# EAGLE design current shunt (EAGLE 8.3.2)

## Sheet 1 of 3
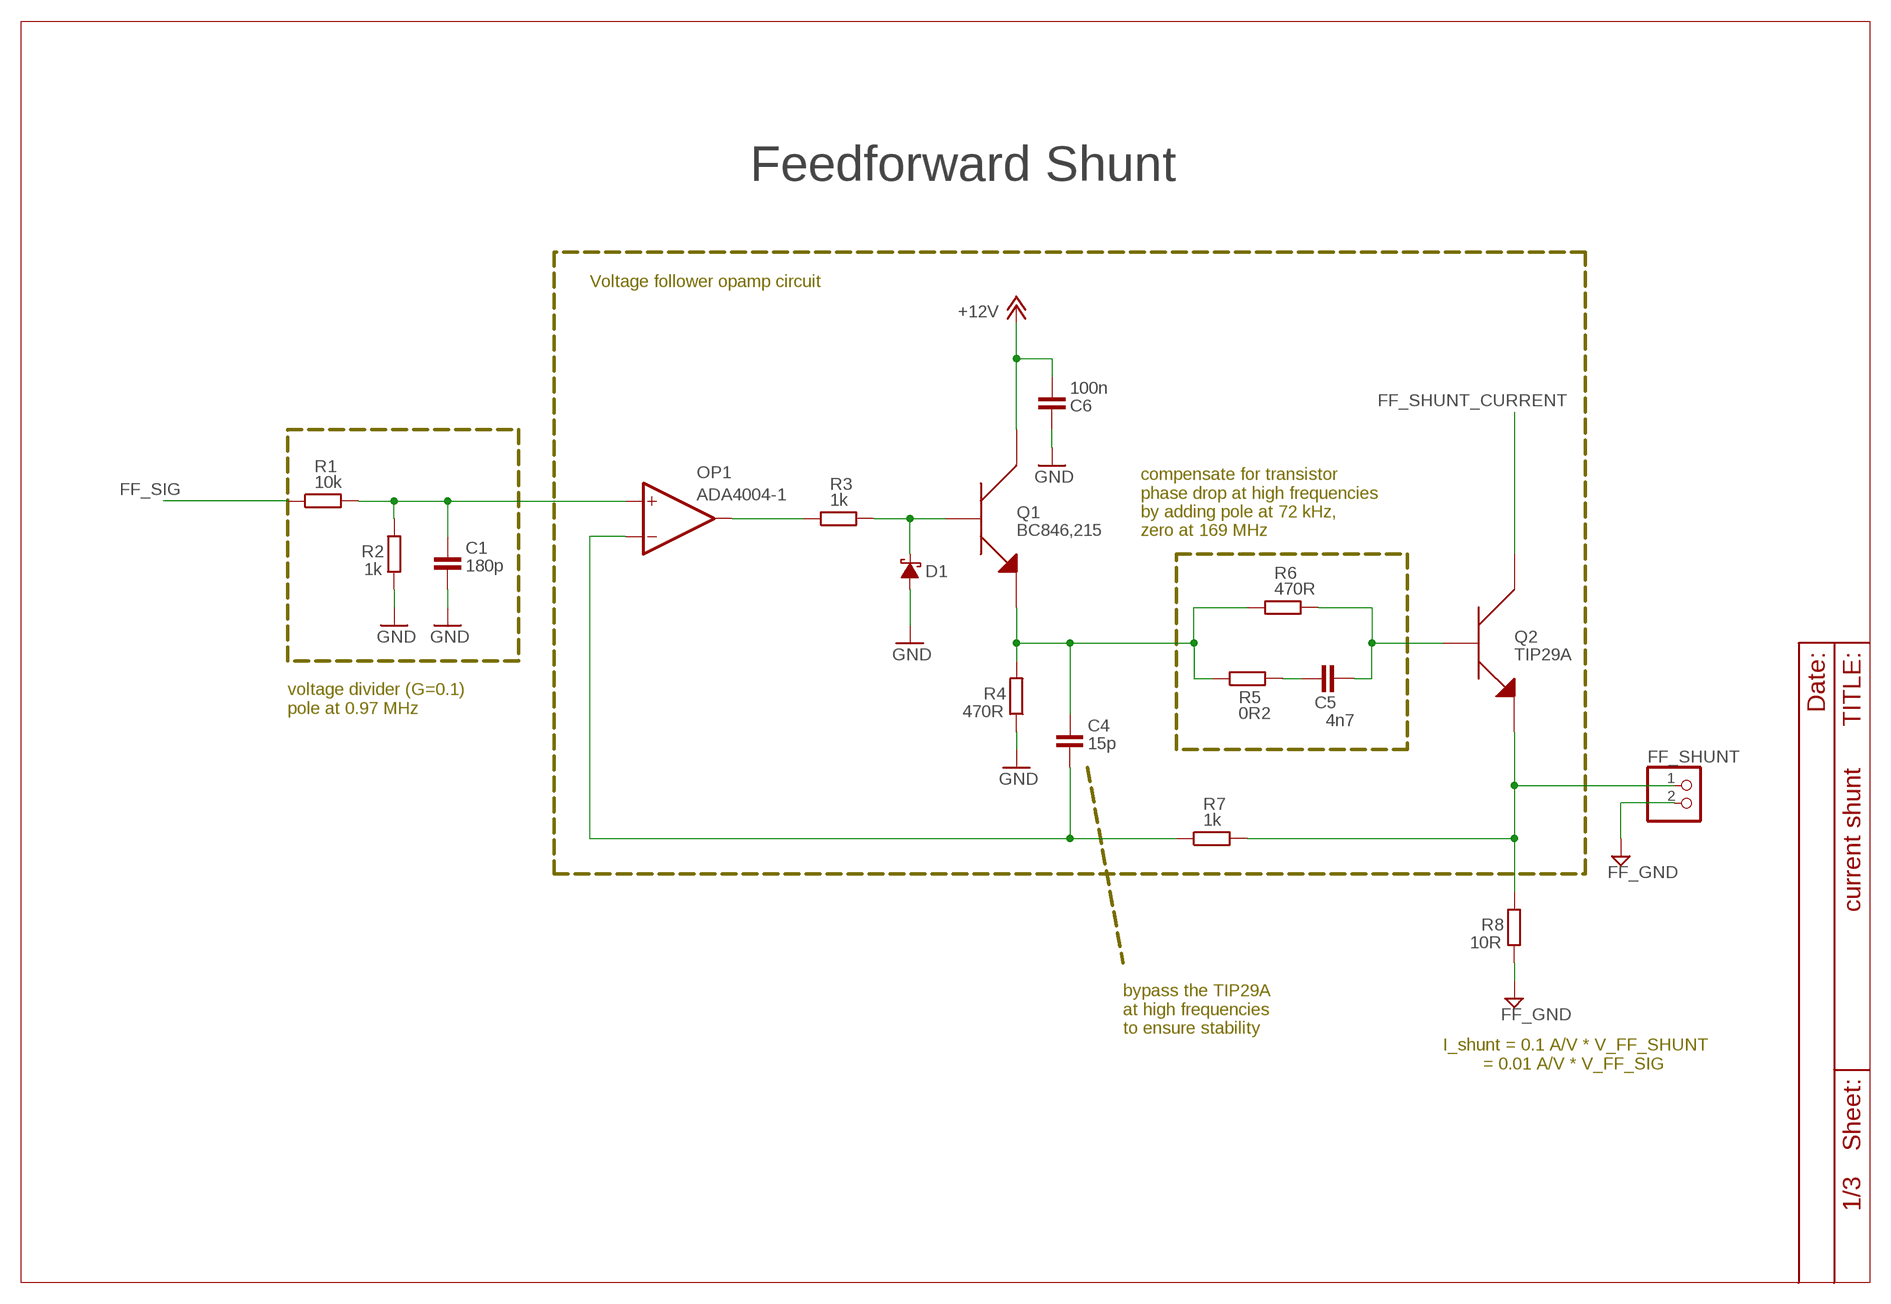
[diagram p0: schematic, sheet 1]

### Parts
C1  180p  CAP0603  [0603]
C4  15p  CAP0603  [0603]
C5  4n7  CAP0603  [0603]
C6  100n  CAP0603  [0603]
D1  DIODE_SCHOTTKY  [SOD123F]
FF_SHUNT  PINHD-1X2  [1X02]
OP1  ADA4004-1  OPAMPSOT23-5  [SOT23-5]
Q1  BC846,215  [SOT23]
Q2  TIP29A  [TO-220_DETATCHED]
R1  10k  RES0603  [0603]
R2  1k  RES0603  [0603]
R3  1k  RES0603  [0603]
R4  470R  RES0603  [0603]
R5  0R2  RES0603  [0603]
R6  470R  RES0603  [0603]
R7  1k  RES0603  [0603]
R8  10R  RES0603  [0603]

### Nets
+12V: C6.1 Q1.3(COLLECTOR) ; also sheet 2,3
FB_SHUNT: FF_SHUNT.1 Q2.EMITTER R7.2 R8.2
FF_GND: FF_SHUNT.2 R8.1 ; also sheet 3
FF_SHUNT_CURRENT: Q2.COLLECTOR ; also sheet 3
FF_SIG: R1.1 ; also sheet 3
GND: C1.2 C6.2 D1.P$2(A) R2.1 R4.1 ; also sheet 2,3
N$1: C4.2 OP1.4(-IN) R7.1
N$2: C1.1 OP1.3(+IN) R1.2 R2.2
N$3: C5.1 R5.2
N$4: OP1.1(OUT) R3.1
N$5: D1.P$1(K) Q1.1(BASE) R3.2
N$8: C4.1 Q1.2(EMITTER) R4.2 R5.1 R6.1
N$9: C5.2 Q2.BASE R6.2

### Notes on the sheet
- Feedforward Shunt
- Voltage follower opamp circuit
- compensate for transistor 
  phase drop at high frequencies
  by adding pole at 72 kHz, 
  zero at 169 MHz
- voltage divider (G=0.1)
  pole at 0.97 MHz
- bypass the TIP29A 
  at high frequencies 
  to ensure stability
- I_shunt = 0.1 A/V * V_FF_SHUNT
          = 0.01 A/V * V_FF_SIG

## Sheet 2 of 3
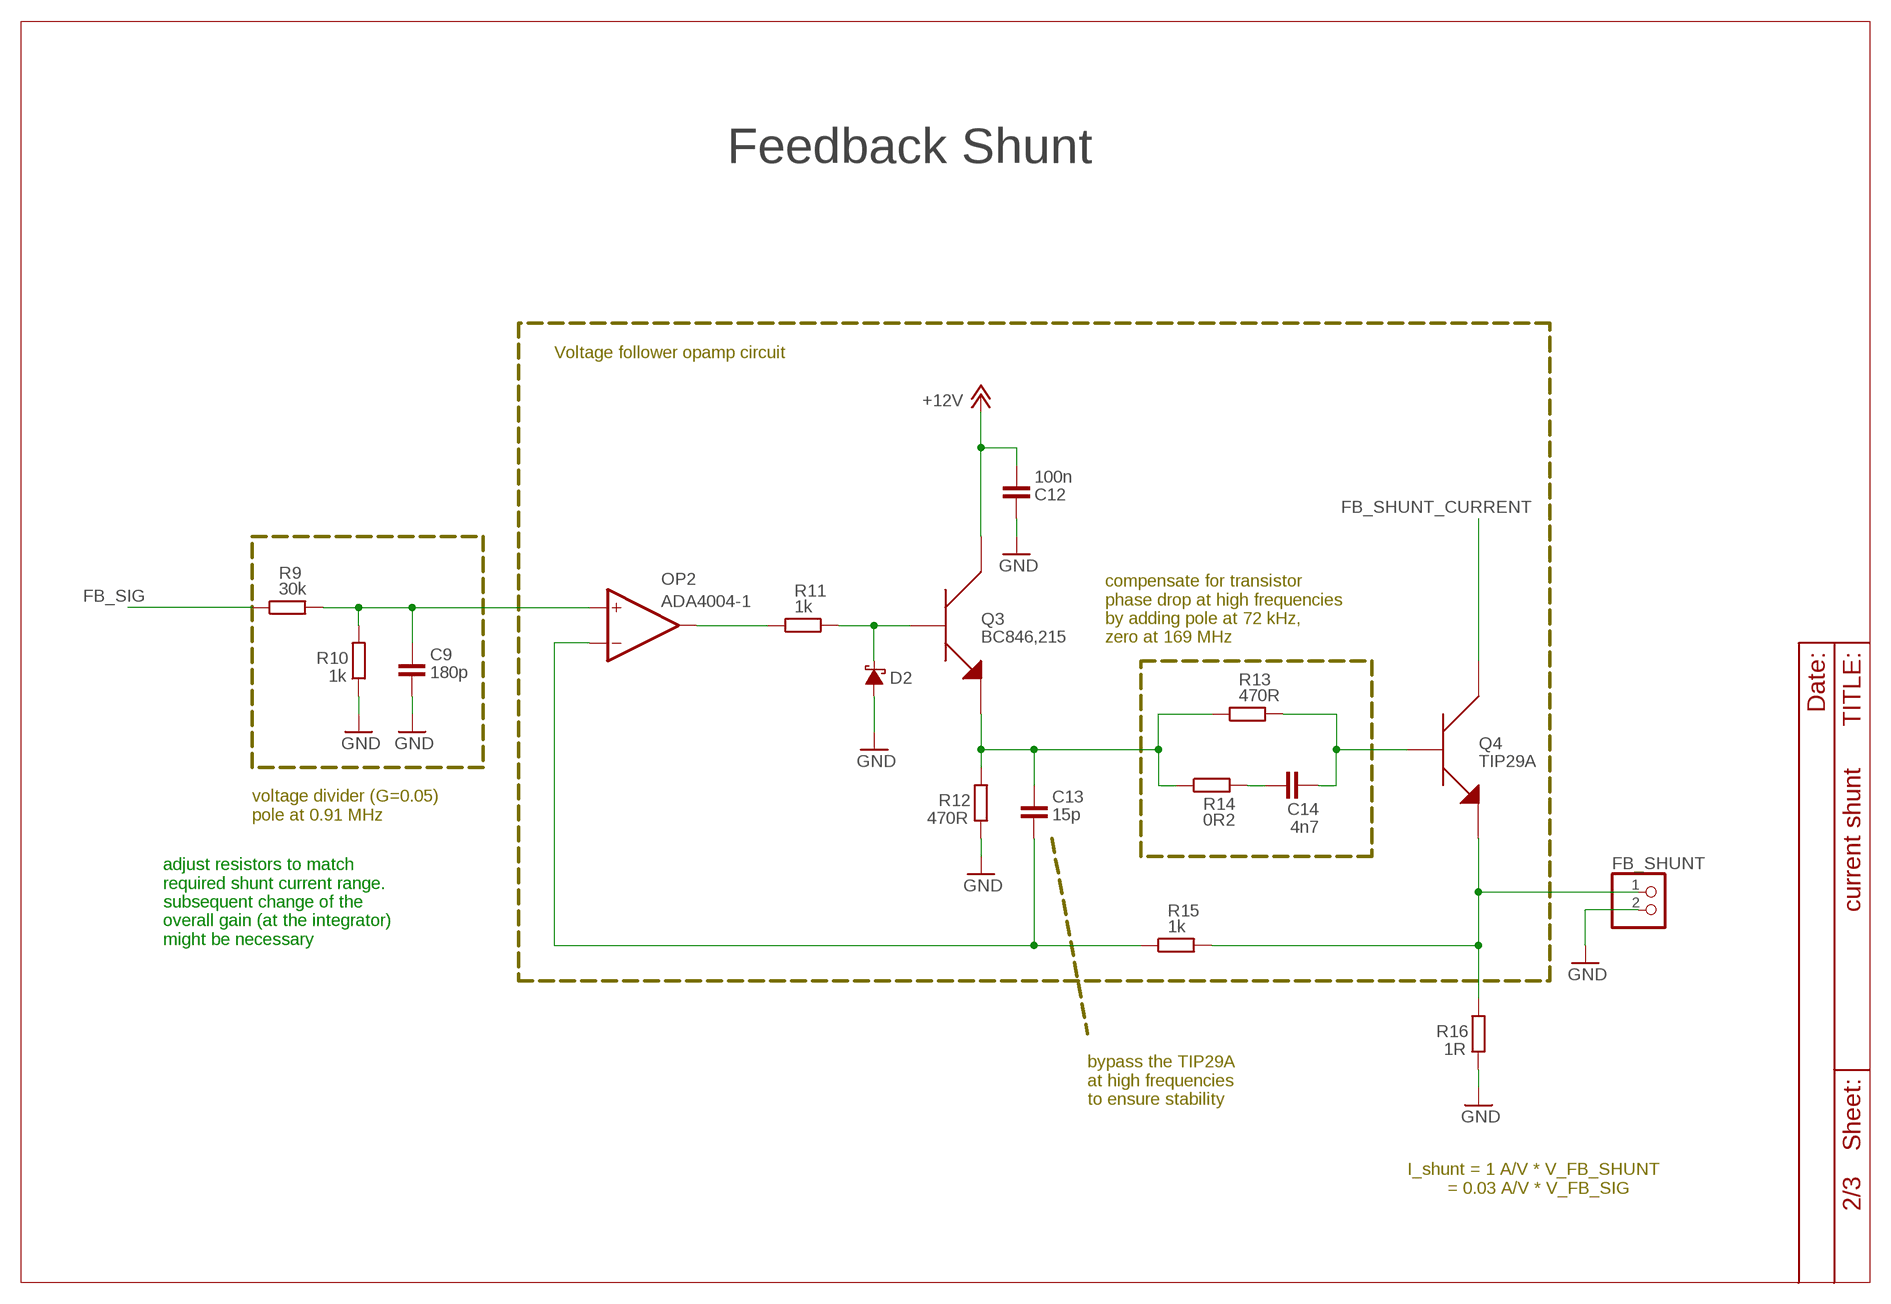
[diagram p1: schematic, sheet 2]

### Parts
C9  180p  CAP0603  [0603]
C12  100n  CAP0603  [0603]
C13  15p  CAP0603  [0603]
C14  4n7  CAP0603  [0603]
D2  DIODE_SCHOTTKY  [SOD123F]
FB_SHUNT  PINHD-1X2  [1X02]
OP2  ADA4004-1  OPAMPSOT23-5  [SOT23-5]
Q3  BC846,215  [SOT23]
Q4  TIP29A  [TO-220_DETATCHED]
R9  30k  RES0603  [0603]
R10  1k  RES0603  [0603]
R11  1k  RES0603  [0603]
R12  470R  RES0603  [0603]
R13  470R  RES0603  [0603]
R14  0R2  RES0603  [0603]
R15  1k  RES0603  [0603]
R16  1R  RES0603  [0603]

### Nets
+12V: C12.1 Q3.3(COLLECTOR) ; also sheet 1,3
FB_SHUNT_CURRENT: Q4.COLLECTOR ; also sheet 3
FB_SIG: R9.1 ; also sheet 3
FF_SHUNT: FB_SHUNT.1 Q4.EMITTER R15.2 R16.2
GND: C9.2 C12.2 D2.P$2(A) FB_SHUNT.2 R10.1 R12.1 R16.1 ; also sheet 1,3
N$10: C13.2 OP2.4(-IN) R15.1
N$14: C9.1 OP2.3(+IN) R9.2 R10.2
N$15: OP2.1(OUT) R11.1
N$16: D2.P$1(K) Q3.1(BASE) R11.2
N$18: C13.1 Q3.2(EMITTER) R12.2 R13.1 R14.1
N$19: C14.2 Q4.BASE R13.2
N$20: C14.1 R14.2

### Notes on the sheet
- Feedback Shunt
- Voltage follower opamp circuit
- compensate for transistor 
  phase drop at high frequencies
  by adding pole at 72 kHz, 
  zero at 169 MHz
- voltage divider (G=0.05)
  pole at 0.91 MHz
- adjust resistors to match 
  required shunt current range. 
  subsequent change of the
  overall gain (at the integrator)
  might be necessary
- bypass the TIP29A 
  at high frequencies 
  to ensure stability
- I_shunt = 1 A/V * V_FB_SHUNT
          = 0.03 A/V * V_FB_SIG

## Sheet 3 of 3
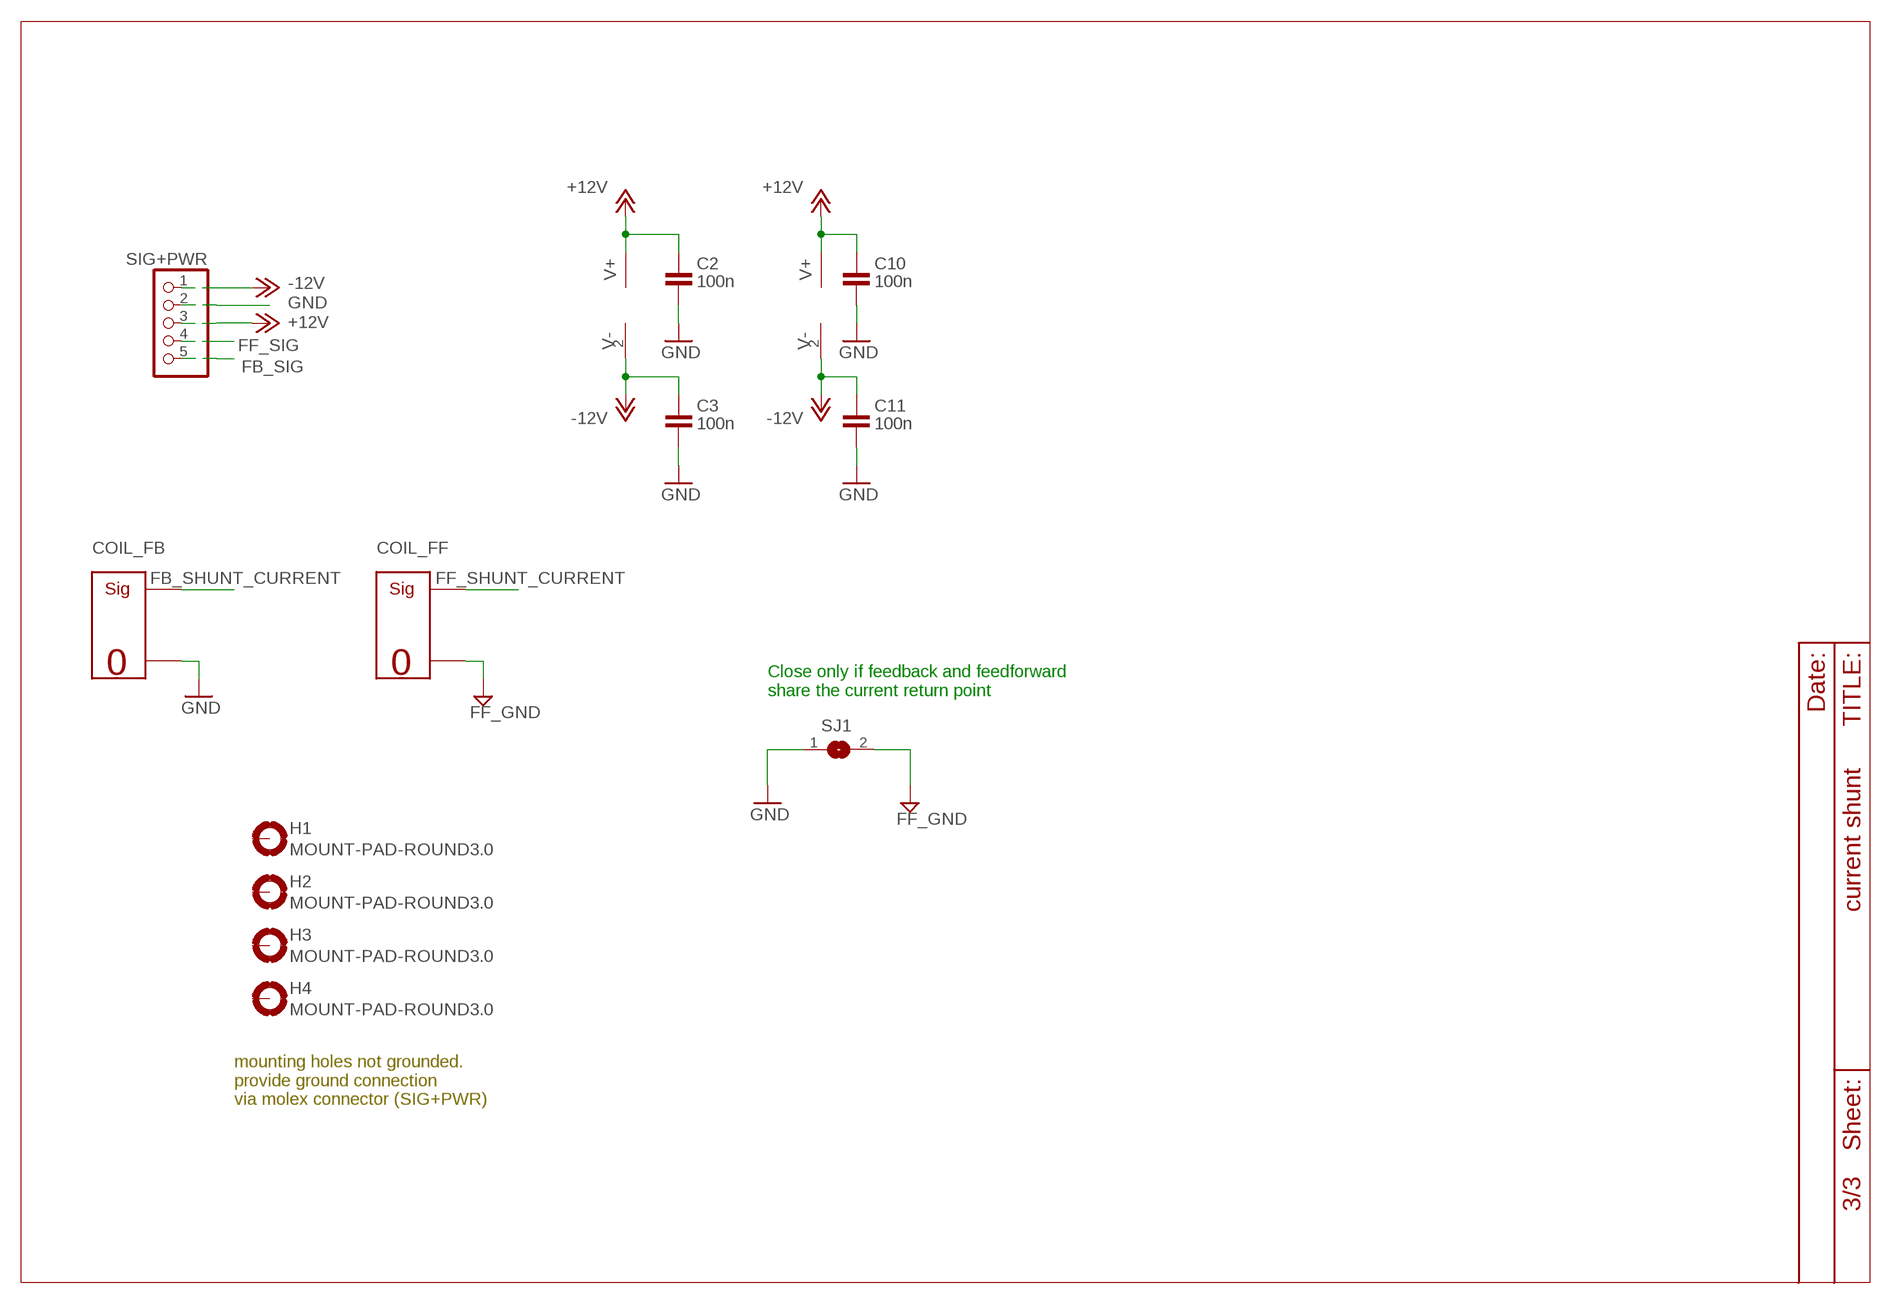
[diagram p2: schematic, sheet 3]

### Parts
C2  100n  CAP0603  [0603]
C3  100n  CAP0603  [0603]
C10  100n  CAP0603  [0603]
C11  100n  CAP0603  [0603]
COIL_FB  MOLEX_SIG_2PIN  [MOLEX-2PIN]
COIL_FF  MOLEX_SIG_2PIN  [MOLEX-2PIN]
H1  MOUNT-PAD-ROUND3.0  [3,0-PAD]
H2  MOUNT-PAD-ROUND3.0  [3,0-PAD]
H3  MOUNT-PAD-ROUND3.0  [3,0-PAD]
H4  MOUNT-PAD-ROUND3.0  [3,0-PAD]
SIG+PWR  MOLEX-KK-1X5  [MOLEX-KK-5PIN]
SJ1  SJ  [SJ]

### Nets
+12V: C2.1 C10.1 OP1.5(V+) OP2.5(V+) SIG+PWR.3 ; also sheet 1,2
-12V: C3.1 C11.1 OP1.2(V-) OP2.2(V-) SIG+PWR.1
FB_SHUNT_CURRENT: COIL_FB.2(SIG) ; also sheet 2
FB_SIG: SIG+PWR.5 ; also sheet 2
FF_GND: COIL_FF.1(GND) SJ1.2 ; also sheet 1
FF_SHUNT_CURRENT: COIL_FF.2(SIG) ; also sheet 1
FF_SIG: SIG+PWR.4 ; also sheet 1
GND: C2.2 C3.2 C10.2 C11.2 COIL_FB.1(GND) SIG+PWR.2 SJ1.1 ; also sheet 1,2
Unconnected: H1.B3,0(MOUNT) H2.B3,0(MOUNT) H3.B3,0(MOUNT) H4.B3,0(MOUNT)

### Notes on the sheet
- Close only if feedback and feedforward
  share the current return point
- mounting holes not grounded.
  provide ground connection
  via molex connector (SIG+PWR)

## Library data of the parts
C1-C6 C9-C14 = custom-passive:CAP: plastic film capacitor, 22.5mm lead spacing, 26.5 x 8.5 mm
COIL_FB COIL_FF = custom-con:MOLEX_SIG_2PIN: 2 pin Molex KK connector for 1 signal puls GND.
D1 D2 = custom-passive:DIODE_SCHOTTKY: Schottky diodes.
FB_SHUNT FF_SHUNT = pinhead:PINHD-1X2: PIN HEADER
H1-H4 = custom:MOUNT-PAD-ROUND: MOUNTING PAD, round
OP1 OP2 = custom-ic:OPAMP: Suitable for most OpAmps.
Q1 Q3 = custom:BC846,215: NPN transistor (Farnell part number 1081227).
Q2 Q4 = custom:TIP29A: NPN transistor (Farnell part number 9294309).
R1-R16 = custom-passive:RES
SIG+PWR = custom-con:MOLEX-KK-1X5: Molex KK 6373 Series 2.54mm pitch 1x5 pins Farnell Part Number: 1462952
SJ1 = jumper:SJ: SMD solder JUMPER

## Board
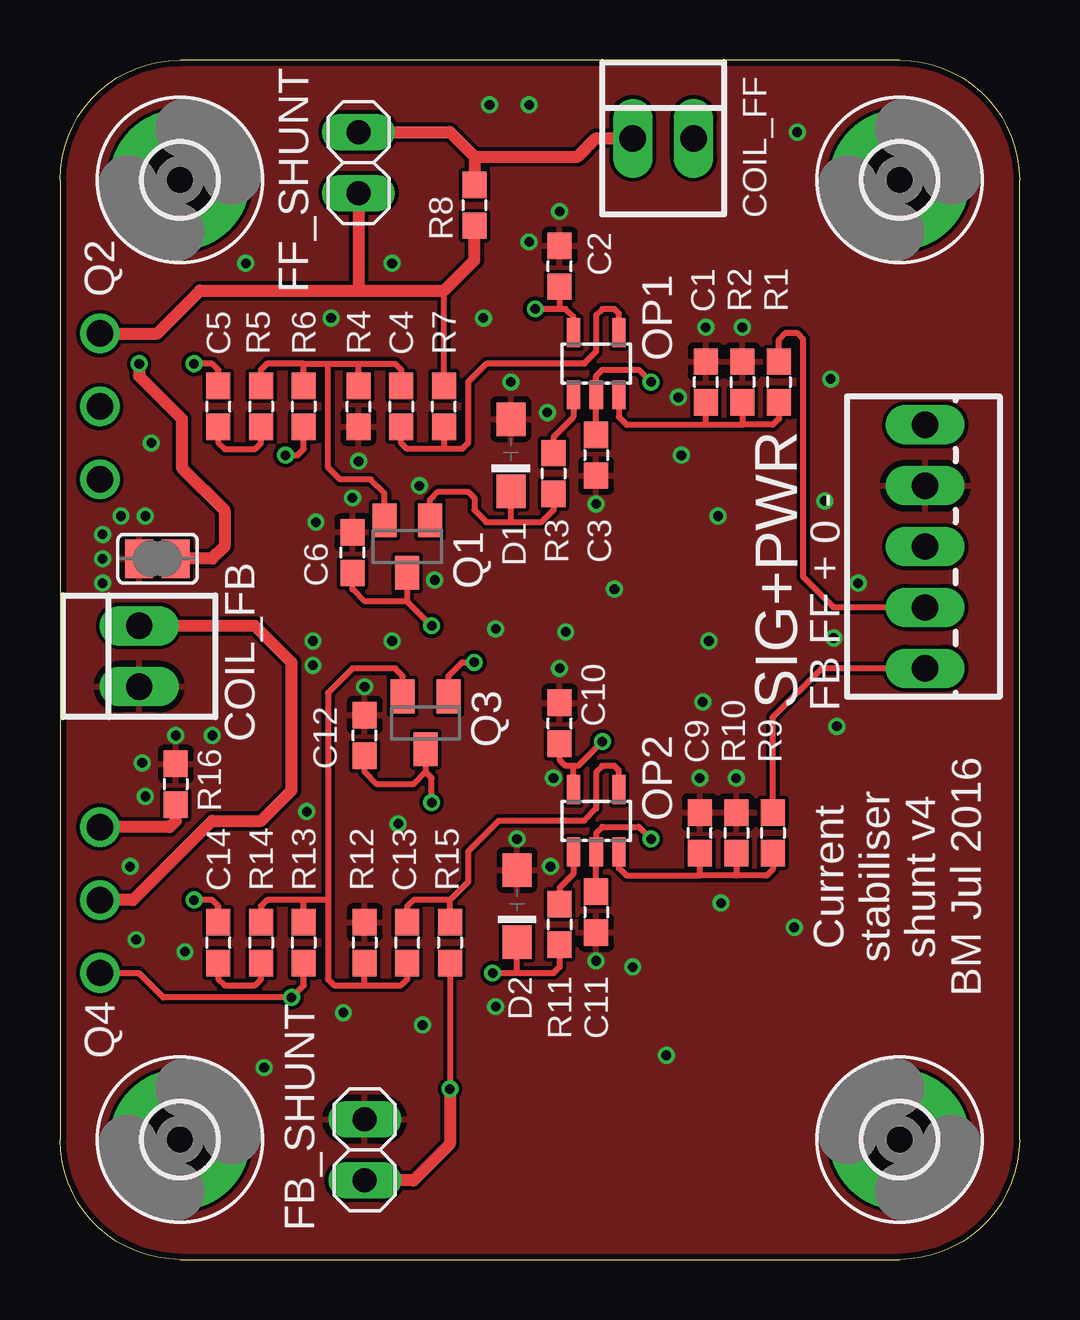
[diagram p3: board, top side]
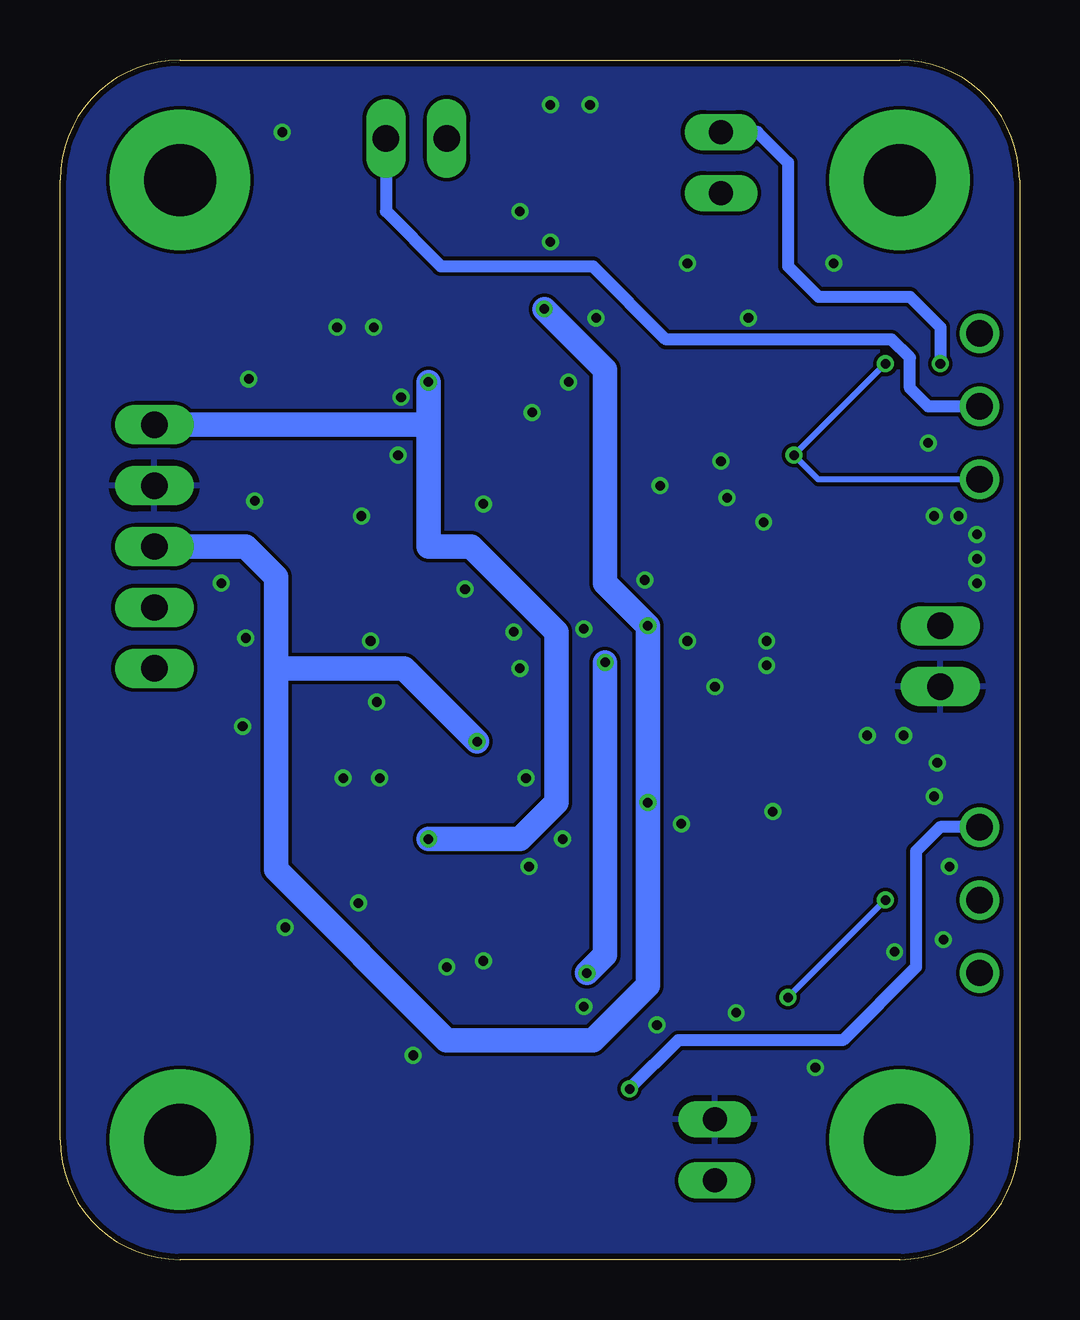
[diagram p4: board, bottom side, seen from below]

Size 40 x 50 mm. Coordinates in mm from the lower left corner, seen from the top.
Outline: 40,5 40,45 arc90 35,50 5,50 arc90 0,45 0,5 arc90 5,0 35,0 arc90 40,5
Copper layers (1*16): Top 0.035mm / dielectric 1.5mm / Bottom 0.035mm
Design rules "ITEADstudio_DRC *": minimum track width 6mil, minimum drill 0.3mm, track to track 6mil, track to pad 6mil, pad to pad 6mil, via to via 6mil, smd to smd 0mil, copper to edge 10mil, drill to drill 10mil, minimum pad ring 10mil, minimum via ring 6mil, stop-mask expansion 2mil, vias tented up to drill 100mil, thermal gap 10mil

### Footprints (pad centres in the part's own frame; a part is rotated, then mirrored left to right if it is on the bottom)
0603 = smd 1.1 x 1: 1 -0.85,0; 2 0.85,0
MOLEX-2PIN = drill 1.1 long: 1 -1.27,0; 2 1.27,0
SOD123F = smd 1.4 x 1.2: P$1 -1.5,0; P$2 1.5,0
1X02 = drill 1.016 long: 1 -1.27,0; 2 1.27,0
3,0-PAD = drill 3 pad 5.842: B3,0 0,0
SOT23-5 = smd 0.55 x 1.2: 1 -0.95,-1.3; 2 0,-1.3; 3 0.95,-1.3; 4 0.95,1.3; 5 -0.95,1.3
SOT23 = smd 1 x 1.4: 1 -0.95,-1.1; 2 0.95,-1.1; 3 0,1.1
TO-220_DETATCHED = drill 1.1: BASE -3.04,-0.39; COLLECTOR 0,-0.39; EMITTER 3.04,-0.39
MOLEX-KK-5PIN = drill 1.1 long: 1 -5.08,0; 2 -2.54,0; 3 0,0; 4 2.54,0; 5 5.08,0
SJ = smd 1.168 x 1.6: 1 -0.762,0; 2 0.762,0

### Placement (x,y rotation side)
C1  26.92,36.58 90 top
C2  20.83,41.4 90 top
C3  22.35,33.53 270 top
C4  14.22,35.56 270 top
C5  6.6,35.56 90 top
C6  12.19,29.46 90 top
C9  26.67,17.78 90 top
C10  20.83,22.35 90 top
C11  22.35,14.48 270 top
C12  12.7,21.84 90 top
C13  14.48,13.21 90 top
C14  6.6,13.21 90 top
COIL_FB  3.3,25.15 90 top
COIL_FF  25.15,46.74 0 top
D1  18.8,33.53 90 top
D2  19.05,14.73 90 top
FB_SHUNT  12.7,4.57 90 top
FF_SHUNT  12.45,45.72 90 top
H1  35,45 0 top
H2  35,5 90 top
H3  5,5 0 top
H4  5,45 0 top
OP1  22.35,37.34 0 top
OP2  22.35,18.29 0 top
Q1  14.48,29.72 180 top
Q2  1.27,35.56 90 top
Q3  15.24,22.37 180 top
Q4  1.27,14.99 90 top
R1  29.97,36.58 270 top
R2  28.45,36.58 270 top
R3  20.57,32.77 270 top
R4  12.45,35.56 90 top
R5  8.38,35.56 270 top
R6  10.16,35.56 270 top
R7  16,35.56 90 top
R8  17.27,43.94 270 top
R9  29.72,17.78 270 top
R10  28.19,17.78 270 top
R11  20.83,13.97 270 top
R12  12.7,13.21 270 top
R13  10.16,13.21 270 top
R14  8.38,13.21 270 top
R15  16.26,13.21 270 top
R16  4.83,19.81 270 top
SIG+PWR  36.07,29.72 270 top
SJ1  4.06,29.21 0 top

### Tracks (layer width: path | path; a pad name or v marks a point on that pad's centre or on a via)
+12V  (via drill 0.4)
  Top 0.254: 15.24,20.32 14.73,19.81 13.21,19.81 12.7,20.32 C12.1 | Q3.3 15.24,20.32 | 15.24,20.32 15.49,20.07 v15.49,19.05 | Q1.3 14.48,27.43 | 14.48,27.43 12.7,27.43 12.19,27.94 C6.1 | 14.48,27.43 v15.49,26.42 | OP1.5 21.4,39.3 21.08,39.62 20.83,39.62 | 20.83,39.62 v19.81,39.62 | C2.1 20.83,39.62 | C10.1 20.83,20.83 21.08,20.57 21.4,20.57 | v22.61,21.59 21.59,20.57 21.4,20.57 | OP2.5 21.4,20.57
  Bottom 1.016: 30.99,24.64 25.65,24.64 v22.61,21.59 | 30.99,24.64 30.99,16.26 23.88,9.14 17.78,9.14 15.49,11.43 v15.49,19.05 v15.49,26.42 17.27,28.19 17.27,37.08 v19.81,39.62 | SIG+PWR.3 32.26,29.72 30.99,28.45 30.99,24.64
-12V  (via drill 0.4)
  Top 0.254: OP1.2 C3.1 22.35,36.83 22.61,37.08 24.13,37.08 v24.64,36.58 | C11.1 OP2.2 22.35,17.78 22.61,18.03 24.13,18.03 v24.64,17.53
  Bottom 1.016: 24.64,34.8 24.64,29.72 22.86,29.72 19.3,26.16 19.3,19.05 20.83,17.53 v24.64,17.53 | 24.64,34.8 v24.64,36.58 | SIG+PWR.1 24.64,34.8
FB_SHUNT
  Top 0.254: R7.2 16,40.39
  Top 0.508: Q2.EMITTER 4.06,38.6 5.84,40.39 12.45,40.39 | FF_SHUNT.1 12.45,40.39 | 12.45,40.39 16,40.39 17.27,41.66 R8.2
FB_SHUNT_CURRENT
  Top 0.508: Q4.COLLECTOR 3.05,14.99 6.35,18.29 8.38,18.29 9.65,19.56 9.65,24.89 8.13,26.42 COIL_FB.2
FB_SIG
  Top 0.254: R9.1 29.72,22.61 31.75,24.64 SIG+PWR.5
FF_GND  (via drill 0.4)
  Top 0.508: FF_SHUNT.2 16.26,46.99 17.27,45.97 | 17.27,45.97 R8.1 | 17.27,45.97 21.59,45.97 22.35,46.74 COIL_FF.1 | v3.3,37.34 3.3,36.83 5.08,35.05 5.08,33.02 6.86,31.24 6.86,29.72 6.35,29.21 SJ1.2
  Bottom 0.508: FF_SHUNT.2 10.92,46.99 9.65,45.72 9.65,41.4 8.38,40.13 4.57,40.13 3.3,38.86 v3.3,37.34
FF_SHUNT  (via drill 0.4)
  Top 0.254: R15.2 v16.26,7.11
  Top 0.508: v16.26,7.11 16.26,4.83 14.73,3.3 FB_SHUNT.1 | Q4.EMITTER 4.56,18.03 4.83,18.29 R16.2
  Bottom 0.508: Q4.EMITTER 3.31,18.03 4.32,17.02 4.32,12.19 7.37,9.14 14.22,9.14 v16.26,7.11
FF_SHUNT_CURRENT
  Bottom 0.508: COIL_FF.2 26.42,43.69 24.13,41.4 17.78,41.4 14.73,38.35 5.33,38.35 4.57,37.59 4.57,36.32 3.81,35.56 Q2.COLLECTOR
FF_SIG
  Top 0.254: R1.1 29.97,38.35 30.23,38.61 30.73,38.61 30.99,38.35 30.99,28.45 32.26,27.18 SIG+PWR.4
GND  (via drill 0.4)
  other vias: 12.7,23.88 4.83,21.84 19.05,17.53 22.35,12.45 23.88,12.19 26.67,20.07 28.19,20.07 23.11,27.94 20.83,24.64 20.57,20.07 22.35,31.5 26.92,38.86 28.45,38.86 20.32,35.31 12.45,33.27 18.8,36.58 12.19,31.75 14.99,32.26 6.35,21.84 3.56,19.3 19.56,48.13 20.83,43.69 27.43,30.99 25.91,33.53 25.78,35.94 18.16,26.29 27.05,25.78 26.8,23.24 32.38,22.23 32.26,25.91 31.88,31.62 32.13,36.7 30.61,13.84 27.56,14.86 25.27,8.51 15.11,9.78 8.51,8 11.81,10.29 5.21,12.83 3.17,13.34 2.92,16.38 3.43,20.7 10.29,18.67 17.91,48.13 10.54,25.78 13.84,25.78 15.62,28.32 14.1,18.16 18.16,10.54 20.45,16.38 13.84,41.53 7.75,41.53 11.3,39.24 17.65,39.24 2.54,30.99 33.27,28.19 21.08,26.16 10.54,24.77 3.81,34.04 30.73,46.99 19.56,42.42 10.67,30.73 3.56,30.99 1.78,30.23 1.78,29.21 1.78,28.19
  pour Bottom (rank 2): 0,0 40,0 40,50 0,50
  pour Top (rank 2): 0,0 40,0 40,50 0,50
N$1
  Top 0.254: R7.1 16,33.78 | 16,33.78 16.76,33.78 17.02,34.04 17.02,36.58 17.78,37.34 21.84,37.34 22.35,37.85 22.35,39.37 22.61,39.62 23.11,39.62 23.3,39.44 OP1.4 | 16,33.78 14.48,33.78 14.22,34.04 C4.2
N$2
  Top 0.254: R1.2 29.97,35.05 29.72,34.8 28.45,34.8 | 26.92,34.8 C1.1 | R2.2 28.45,34.8 | OP1.3 23.3,35.12 23.62,34.8 26.92,34.8 | 26.92,34.8 28.45,34.8
N$3
  Top 0.254: C5.1 6.6,34.04 6.86,33.78 8.13,33.78 8.38,34.04 R5.2
N$4
  Top 0.254: OP1.1 21.4,35.12 20.57,34.29 R3.1
N$5
  Top 0.254: R3.2 20.57,31.24 20.07,30.73 18.8,30.73 | 18.8,30.73 D1.P$1 | Q1.1 15.43,31.68 15.75,32 17.02,32 17.27,31.75 17.27,31.24 17.78,30.73 18.8,30.73
N$8
  Top 0.254: R4.2 12.45,37.34 | C4.1 14.22,37.08 13.97,37.34 12.45,37.34 | R5.1 8.38,37.08 8.64,37.34 10.16,37.34 | Q1.2 13.53,31.94 12.95,32.51 11.68,32.51 11.18,33.02 11.18,37.34 | R6.1 10.16,37.34 | 10.16,37.34 11.18,37.34 | 11.18,37.34 12.45,37.34
N$9  (via drill 0.4)
  Top 0.254: C5.2 6.6,37.08 6.35,37.34 v5.59,37.34 | v9.4,33.53 9.91,33.53 10.16,33.78 R6.2
  Bottom 0.254: v5.59,37.34 v9.4,33.53 8.39,32.52 Q2.BASE
N$10
  Top 0.254: OP2.4 23.3,20.39 23.11,20.57 22.61,20.57 22.35,20.32 22.35,18.8 21.84,18.29 18.29,18.29 17.02,17.02 17.02,15.75 16.26,14.99 | R15.1 16.26,14.99 | C13.2 14.48,14.73 14.73,14.99 16.26,14.99
N$14
  Top 0.254: R9.2 29.72,16.26 29.46,16 28.19,16 | 28.19,16 26.67,16 | 26.67,16 C9.1 | R10.2 28.19,16 | OP2.3 23.3,16.32 23.62,16 26.67,16
N$15
  Top 0.254: OP2.1 21.4,16.07 20.83,15.49 R11.1
N$16  (via drill 0.4)
  Top 0.254: 19.05,11.94 D2.P$1 | R11.2 20.83,12.19 20.57,11.94 19.05,11.94 | v18.03,11.94 19.05,11.94 | Q3.1 16.19,24.32 16.76,24.89 v17.27,24.89
  Bottom 1.016: v18.03,11.94 17.27,12.7 v17.27,24.89
N$18
  Top 0.254: 11.18,14.99 10.16,14.99 | 10.16,14.99 8.64,14.99 8.38,14.73 R14.1 | C13.1 14.48,11.68 14.22,11.43 12.7,11.43 | 12.7,11.43 R12.2 | R13.1 10.16,14.99 | 12.7,11.43 11.43,11.43 11.18,11.68 11.18,14.99 | Q3.2 14.29,24.32 13.97,24.64 12.19,24.64 11.18,23.62 11.18,14.99
N$19  (via drill 0.4)
  Top 0.254: C14.2 6.6,14.73 6.35,14.99 v5.59,14.99 | R13.2 10.16,11.43 v9.65,10.92 4.3,10.92 3.28,11.95 Q4.BASE
  Bottom 0.254: v5.59,14.99 v9.65,10.92
N$20
  Top 0.254: C14.1 6.6,11.68 6.86,11.43 8.13,11.43 8.38,11.68 R14.2

### Text on the board
tPlace: FB FF + 0 - | Current / stabiliser / shunt v4 / BM Jul 2016
tNames: Q2 | Q4